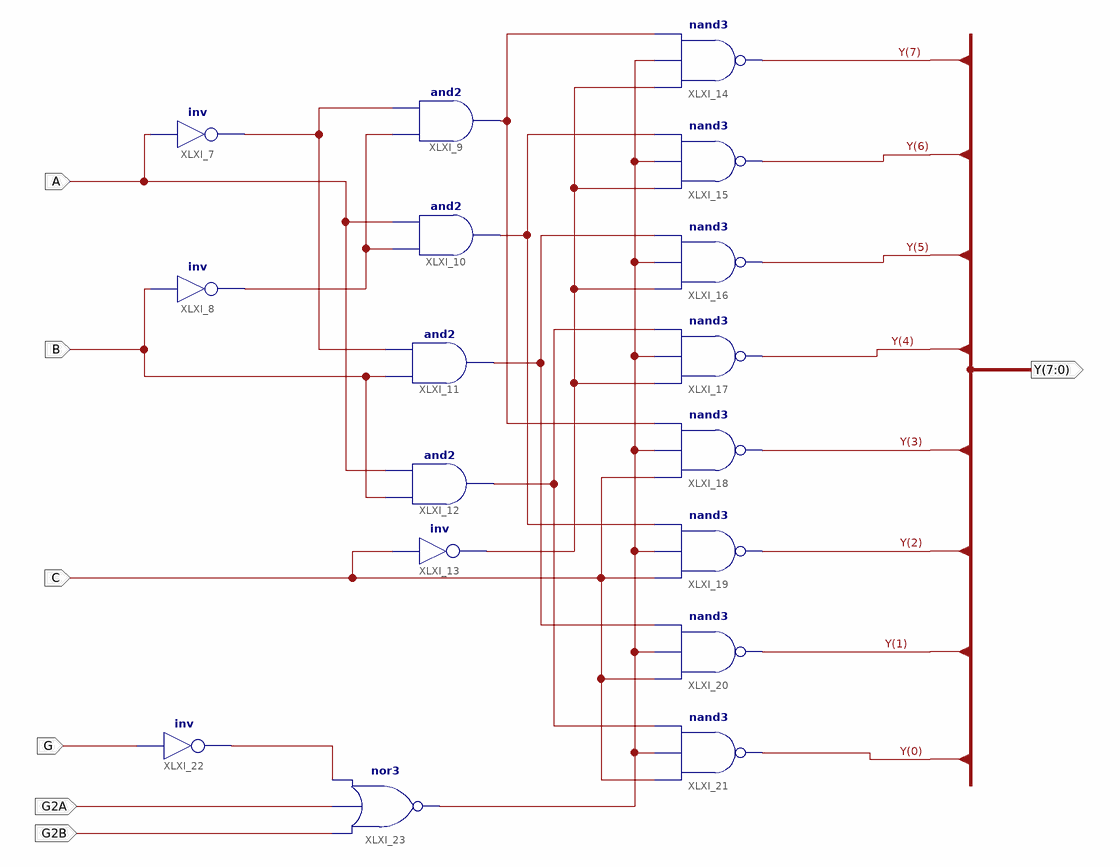
[diagram p0: schematic sheet 1]
// Xilinx ISE schematic D_74LS138_SCH.sch (kintex7) as structural Verilog: 17 symbols, 7 ports
module D_74LS138_SCH (
  input  A,
  input  B,
  input  C,
  input  G,
  input  G2A,
  input  G2B,
  output [7:0] Y
);

  wire XLXN_17, XLXN_21, XLXN_28, XLXN_30, XLXN_32, XLXN_34, XLXN_39, XLXN_47, XLXN_58;

  not XLXI_7 (XLXN_17, A);
  not XLXI_8 (XLXN_21, B);
  and XLXI_9 (XLXN_28, XLXN_21, XLXN_17);
  and XLXI_10 (XLXN_30, XLXN_21, A);
  and XLXI_11 (XLXN_32, B, XLXN_17);
  and XLXI_12 (XLXN_34, B, A);
  not XLXI_13 (XLXN_39, C);
  nand XLXI_14 (Y[7], XLXN_39, XLXN_58, XLXN_28);
  nand XLXI_15 (Y[6], XLXN_39, XLXN_58, XLXN_30);
  nand XLXI_16 (Y[5], XLXN_39, XLXN_58, XLXN_32);
  nand XLXI_17 (Y[4], XLXN_39, XLXN_58, XLXN_34);
  nand XLXI_18 (Y[3], C, XLXN_58, XLXN_28);
  nand XLXI_19 (Y[2], C, XLXN_58, XLXN_30);
  nand XLXI_20 (Y[1], C, XLXN_58, XLXN_32);
  nand XLXI_21 (Y[0], C, XLXN_58, XLXN_34);
  not XLXI_22 (XLXN_47, G);
  nor XLXI_23 (XLXN_58, G2B, G2A, XLXN_47);
endmodule
